# Altium schematic sheet P20_Mini PCIe 4G_5G.SchDoc
size 420 x 297 mm
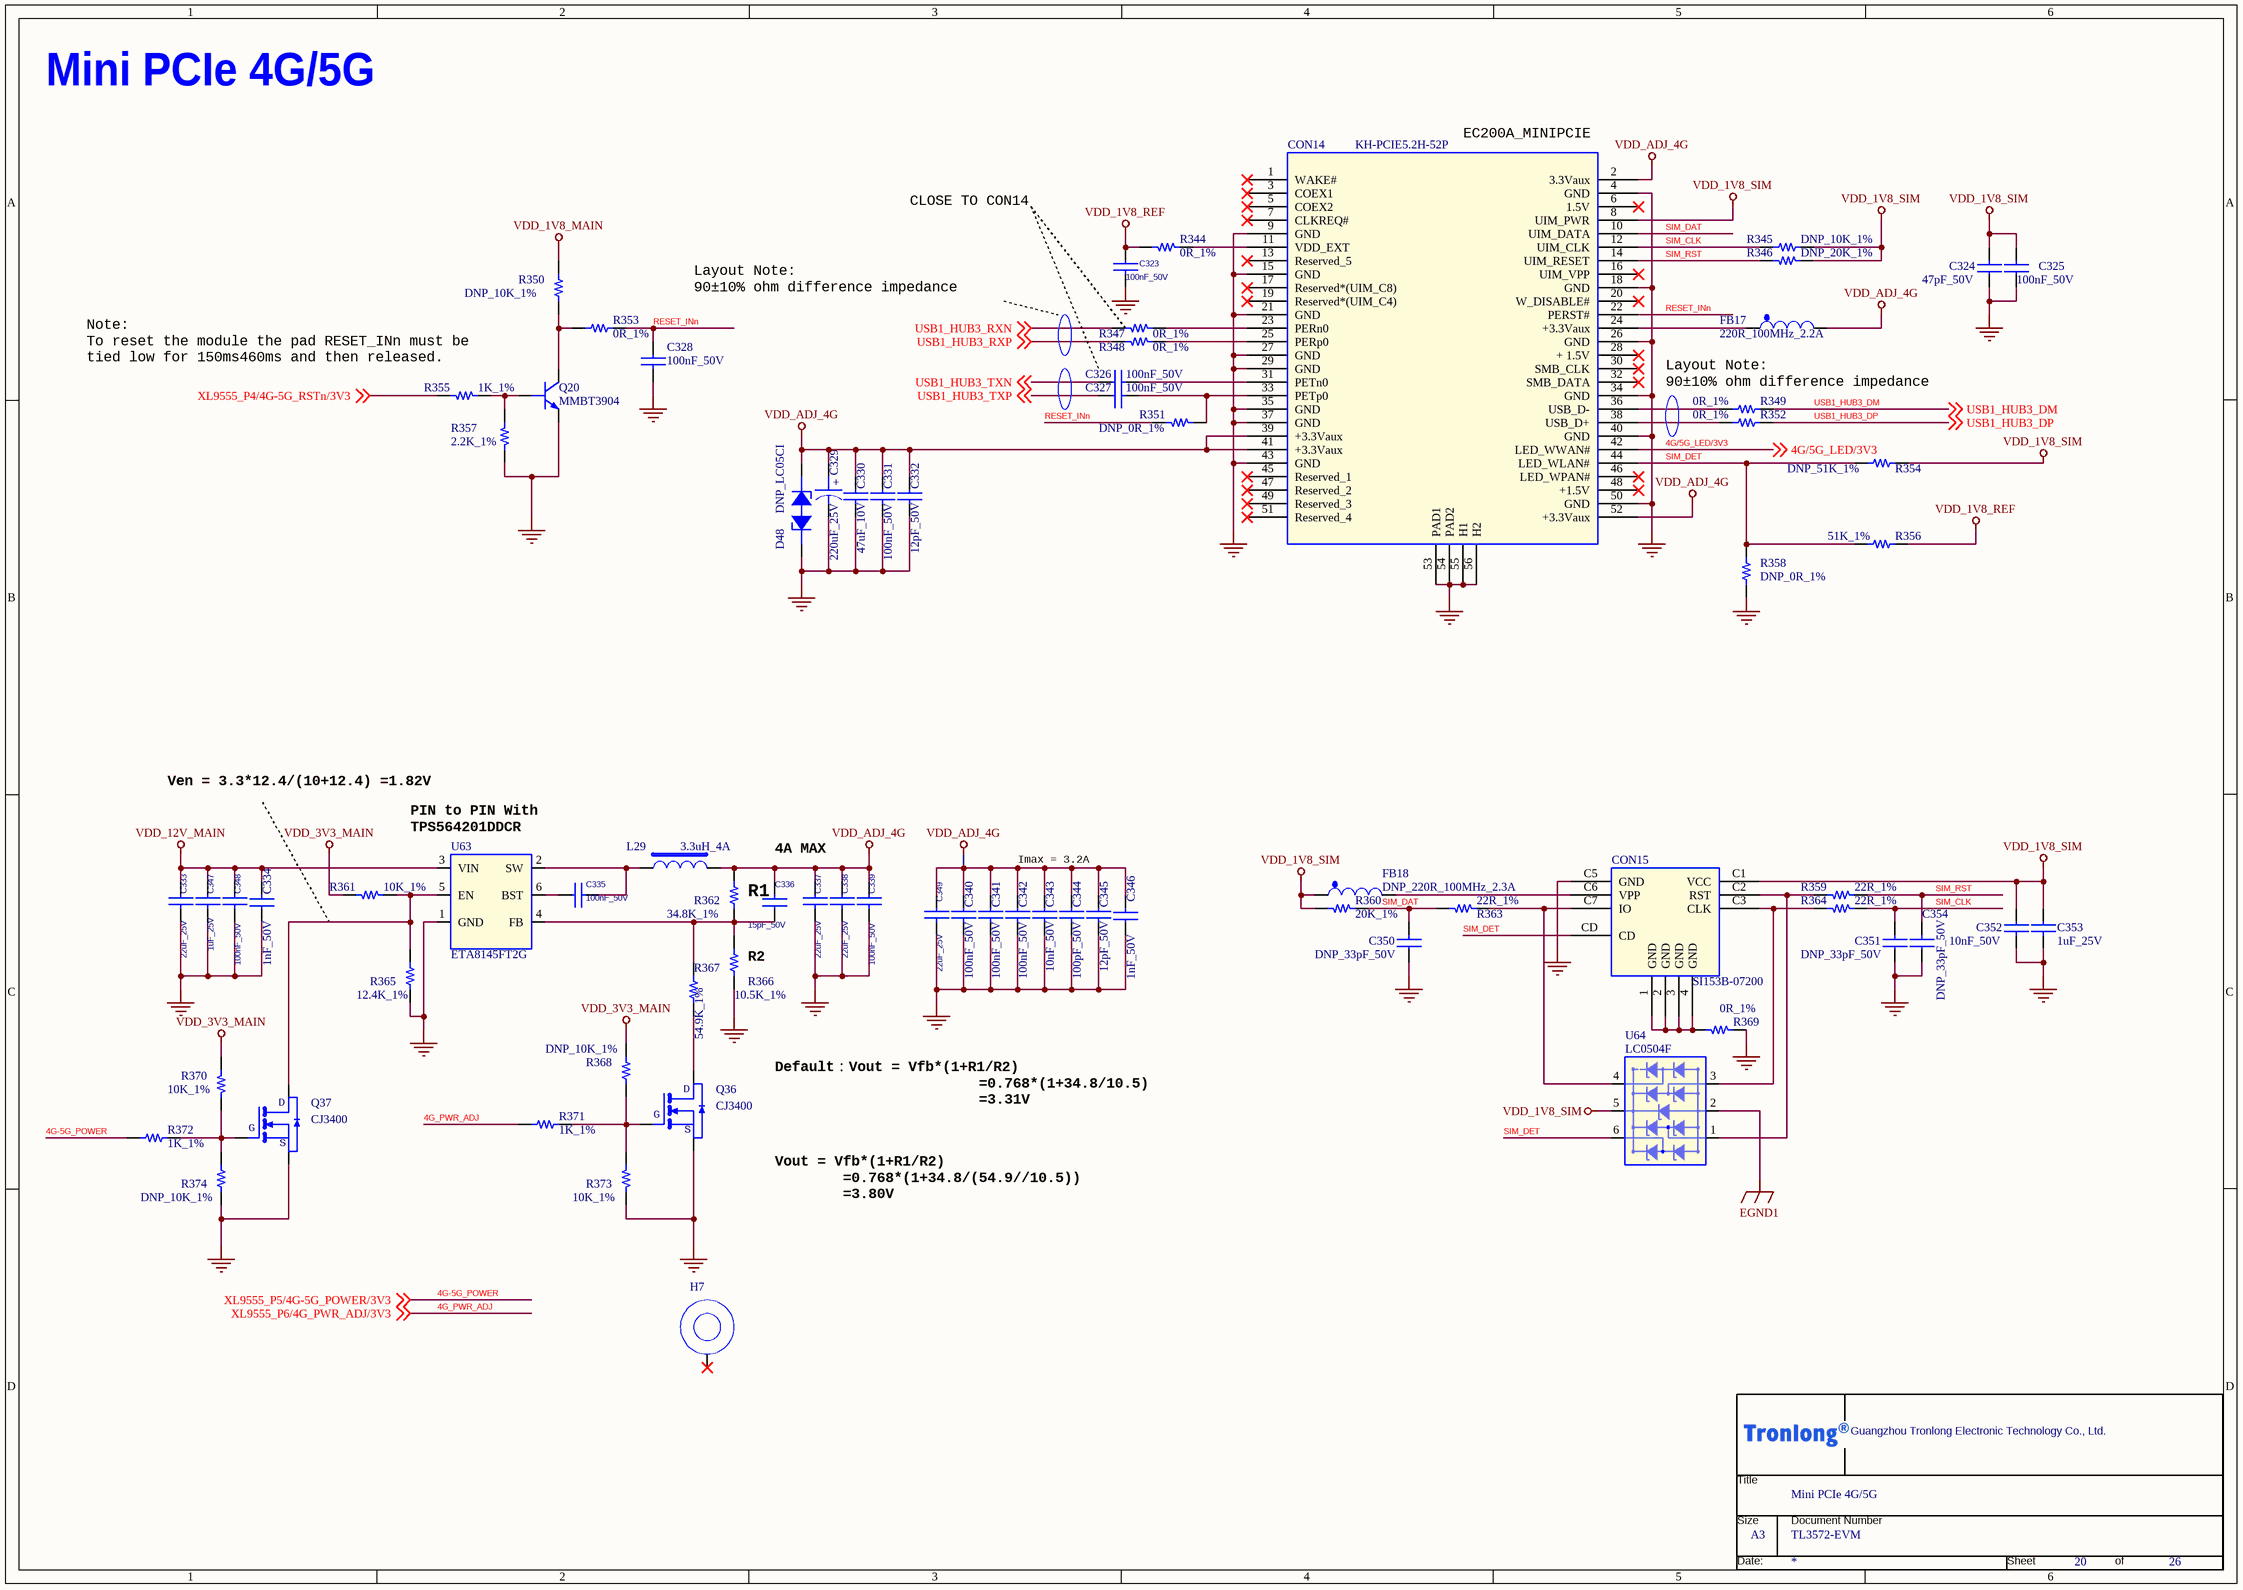
[diagram p0: P20_Mini PCIe 4G_5G.SchDoc]

## Parts
*  Doc: TL3572-EVM  Title: Mini PCIe 4G/5G  OrgName: Guangzhou Tronlong Electronic Technology Co., Ltd.  Page Size: A3  Page Number: 20  Page Count: 26  (hidden comment: Tronlong_TITTLE_20211115)  (graphical)
C323  100nF_50V  [C0402]
C324  47pF_50V  [C0402]
C325  100nF_50V  [C0402]
C326  100nF_50V  [C0402]
C327  100nF_50V  [C0402]
C328  100nF_50V  [C0402]
C329  220uF_25V  [SMD-ALU-L66H66]
C330  47uF_10V  [C0805]
C331  100nF_50V  [C0402]
C332  12pF_50V  [C0402]
C333  22uF_25V  [C0805]
C334  1nF_50V  [C0402]
C335  100nF_50V  [C0402]
C336  15pF_50V  [C0603]
C337  22uF_25V  [C0805]
C338  22uF_25V  [C0805]
C339  100nF_50V  [C0402]
C340  100nF_50V  [C0402]
C341  100nF_50V  [C0402]
C342  100nF_50V  [C0402]
C343  10nF_50V  [C0402]
C344  100pF_50V  [C0402]
C345  12pF_50V  [C0402]
C346  1nF_50V  [C0402]
C347  1uF_25V  [C0402]
C348  100nF_50V  [C0402]
C349  22uF_25V  [C0805]
C350  DNP_33pF_50V  [C0402]
C351  DNP_33pF_50V  [C0402]
C352  10nF_50V  [C0402]
C353  1uF_25V  [C0402]
C354  DNP_33pF_50V  [C0402]
CON14  KH-PCIE5.2H-52P  [aaa-pci-047-k01]
CON15  SI153B-07200  [SIM_SI124C-01200]
D48  DNP_LC05CI  [SOD323_BI]
FB17  220R_100MHz_2.2A  [L0603]
FB18  DNP_220R_100MHz_2.3A  [L0603]
H7  HOLE  [NHOLE_C5_BT]  (value not drawn)
L29  3.3uH_4A  [SMD-L5452M-2P]
Q20  MMBT3904  [SOT23-3_DBZ3]
Q36  CJ3400  [SOT23-3]
Q37  CJ3400  [SOT23-3]
R344  0R_1%  [R0402]
R345  DNP_10K_1%  [R0402]
R346  DNP_20K_1%  [R0402]
R347  0R_1%  [R0402]
R348  0R_1%  [R0402]
R349  0R_1%  [R0402]
R350  DNP_10K_1%  [R0402]
R351  DNP_0R_1%  [R0402]
R352  0R_1%  [R0402]
R353  0R_1%  [R0402]
R354  DNP_51K_1%  [R0402]
R355  1K_1%  [R0402]
R356  51K_1%  [R0402]
R357  2.2K_1%  [R0402]
R358  DNP_0R_1%  [R0402]
R359  22R_1%  [R0402]
R360  20K_1%  [R0603]
R361  10K_1%  [R0402]
R362  34.8K_1%  [R0402]
R363  22R_1%  [R0402]
R364  22R_1%  [R0402]
R365  12.4K_1%  [R0402]
R366  10.5K_1%  [R0402]
R367  54.9K_1%  [R0402]
R368  DNP_10K_1%  [R0402]
R369  0R_1%  [R0402]
R370  10K_1%  [R0402]
R371  1K_1%  [R0402]
R372  1K_1%  [R0402]
R373  10K_1%  [R0402]
R374  DNP_10K_1%  [R0402]
U63  ETA8145FT2G  [SOT-23-6L]
U64  LC0504F  [SOT363]

## Nets
EGND1: U64.2
GND: C323.2 C324.1 C325.1 C328.2 C329.2 C330.2 C331.2 C332.2 C333.2 C334.1 C337.2 C338.2 C339.2 C340.2 C341.2 C342.2 C343.2 C344.2 C345.2 C346.1 C347.2 C348.2 C349.2 C350.1 C351.1 C352.2 C353.2 C354.1 CON14.4(GND) CON14.9(GND) CON14.15(GND) CON14.18(GND) CON14.21(GND) CON14.26(GND) CON14.27(GND) CON14.29(GND) CON14.34(GND) CON14.35(GND) CON14.37(GND) CON14.40(GND) CON14.43(GND) CON14.50(GND) CON14.53(PAD1) CON14.54(PAD2) CON14.55(H1) CON14.56(H2) CON15.C5(GND) D48.2(CATHODE2) Q20.2(E) Q36.2(E) Q37.2(E) R357.2 R358.2 R365.1 R366.1 R369.1 R373.2 R374.2 U63.1(GND)
VDD_1V8_MAIN: R350.2
VDD_1V8_REF: C323.1 R344.1 R356.1
VDD_1V8_SIM: C324.2 C325.2 C352.1 C353.1 CON14.8(UIM_PWR) CON15.C1(VCC) FB18.1 R345.2 R346.2 R354.1 R360.1 U64.5
VDD_3V3_MAIN: R361.1 R368.1 R370.2
VDD_12V_MAIN: C333.1 C334.2 C347.1 C348.1 U63.3(VIN)
VDD_ADJ_4G: C329.1 C330.1 C331.1 C332.1 C336.2 C337.1 C338.1 C339.1 C340.1 C341.1 C342.1 C343.1 C344.1 C345.1 C346.2 C349.1 CON14.2(3.3Vaux) CON14.39(+3.3Vaux) CON14.41(+3.3Vaux) CON14.52(+3.3Vaux) D48.1(ANODE1) FB17.2 L29.2 R362.2
4G-5G_POWER: R372.1 ; off-sheet XL9555_P5/4G-5G_POWER/3V3  [also labelled XL9555_P5/4G-5G_POWER/3V3]
4G/5G_LED/3V3: CON14.42(LED_WWAN#) ; off-sheet 4G/5G_LED/3V3
4G_PWR_ADJ: R371.1 ; off-sheet XL9555_P6/4G_PWR_ADJ/3V3  [also labelled XL9555_P6/4G_PWR_ADJ/3V3]
RESET_INn: C328.1 CON14.22(PERST#) R351.1 R353.2
SIM_CLK: C351.2 CON14.12(UIM_CLK) R345.1 R364.2
SIM_DAT: C350.2 CON14.10(UIM_DATA) R360.2 R363.1
SIM_DET: CON14.44(LED_WLAN#) CON15.CD R354.2 R356.2 R358.1 U64.6
SIM_RST: C354.2 CON14.14(UIM_RESET) R346.1 R359.2
USB1_HUB3_DM: R349.2 ; off-sheet USB1_HUB3_DM
USB1_HUB3_DP: R352.2 ; off-sheet USB1_HUB3_DP
USB1_HUB3_RXN: R347.1 ; off-sheet USB1_HUB3_RXN
USB1_HUB3_RXP: R348.1 ; off-sheet USB1_HUB3_RXP
USB1_HUB3_TXN: C326.1 ; off-sheet USB1_HUB3_TXN
USB1_HUB3_TXP: C327.1 ; off-sheet USB1_HUB3_TXP
XL9555_P4/4G-5G_RSTn/3V3: R355.1 ; off-sheet XL9555_P4/4G-5G_RSTn/3V3
NetC326_2: C326.2 CON14.31(PETn0)
NetC327_2: C327.2 CON14.33(PETp0) R351.2
NetC335_1: C335.1 U63.6(BST)
NetC335_2: C335.2 L29.1 U63.2(SW)
NetC336_1: C336.1 R362.1 R366.2 R367.2 U63.4(FB)
NetCON14_11: CON14.11(VDD_EXT) R344.2
NetCON14_23: CON14.23(PERn0) R347.2
NetCON14_24: CON14.24(+3.3Vaux) FB17.1
NetCON14_25: CON14.25(PERp0) R348.2
NetCON14_36: CON14.36(USB_D-) R349.1
NetCON14_38: CON14.38(USB_D+) R352.1
NetCON15_1: CON15.1(GND) CON15.2(GND) CON15.3(GND) CON15.4(GND) R369.2
NetCON15_C2: CON15.C2(RST) R359.1 U64.1
NetCON15_C3: CON15.C3(CLK) R364.1 U64.3
NetCON15_C6: CON15.C6(VPP) FB18.2
NetCON15_C7: CON15.C7(IO) R363.2 U64.4
NetQ20_1: Q20.1(B) R355.2 R357.1
NetQ20_3: Q20.3(C) R350.1 R353.1
NetQ36_1: Q36.1(B) R368.2 R371.2 R373.1
NetQ36_3: Q36.3(C) R367.1
NetQ37_1: Q37.1(B) R370.1 R372.2 R374.1
NetQ37_3: Q37.3(C) R361.2 R365.2 U63.5(EN)

Not connected (* = marked no-connect by the designer): CON14 1(WAKE#)* 3(COEX1)* 5(COEX2)* 6(1.5V)* 7(CLKREQ#)* 13(Reserved_5)* 16(UIM_VPP)* 17(Reserved*(UIM_C8))* 19(Reserved*(UIM_C4))* 20(W_DISABLE#)* 28(+_1.5V)* 30(SMB_CLK)* 32(SMB_DATA)* 45(Reserved_1)* 46(LED_WPAN#)* 47(Reserved_2)* 48(+1.5V)* 49(Reserved_3)* 51(Reserved_4)*; H7 1*

## Notes on the sheet
- Mini PCIe 4G/5G
- (near CON14) EC200A_MINIPCIE
- CLOSE TO CON14
- Layout Note:
  90±10% ohm difference impedance
- Note:
  To reset the module the pad RESET_INn must be
  tied low for 150ms460ms and then released.
- Ven = 3.3*12.4/(10+12.4) =1.82V
- (near U63) PIN to PIN With
  TPS564201DDCR
- 4A MAX
- Imax = 3.2A
- R1
- (near R366) R2
- Default：Vout = Vfb*(1+R1/R2)
  =0.768*(1+34.8/10.5)
  =3.31V
- Vout = Vfb*(1+R1/R2)
  =0.768*(1+34.8/(54.9//10.5))
  =3.80V
- (in symbol CAP POL) +
- (in symbol MOSFET N SOT) D; G; S
- (in symbol Tronlong_TITTLE_20211115) Title; Size; Document Number; Date:; Sheet; of

## Library data of the parts
* = Tronlong_TITTLE_20211115: RevCode: A?; Page Create Date: March  8, 1995; Page Modify Date: *
C323 = CAP NP_Dup2: 贴片陶瓷电容,100nF,10%,50V,X7R; Manufacturer Character: 中国大陆; Manufacturer: 广东风华高新科技股份有限公司（FH）; Manufacturer PartNumber: 0402B104K500NT; Eco-Label: ROHS; ERP Number: 005.0001.0001.00681; Operation Temperature（℃）: -55~+125(Ta); As-Welded: /; PCB Footprint: C0402; Part Status: 试用; ERP PCB Footprint: C0402; Temperature: -55~125℃
C324 = CAP NP: CC0402JRNPO9BN470; Manufacturer: 广州创龙; Manufacturer PartNumber: 47pF,5%,C0402,50V,（X7R,X5R,COG,NPO或X7S）; Eco-Label: ROHS; ERP PCB Footprint: C0603; ERP Number: 005.0001.0022.00100; As-Welded: /; Operation Temperature（℃）: -40~+85(Ta); PCB Footprint: C0402; Temperature: -55~125℃; Manufacturer Character: -; Part Status: -
C325 = CAP NP: 贴片陶瓷电容,100nF,10%,50V,X7R; Manufacturer: 广东风华高新科技股份有限公司（FH）; Manufacturer PartNumber: 0402B104K500NT; Manufacturer Character: 中国大陆; Eco-Label: ROHS; ERP Number: 005.0001.0001.00681; Operation Temperature（℃）: -55~+125(Ta); As-Welded: /; PCB Footprint: C0402; Part Status: 试用; ERP PCB Footprint: C0402; Temperature: -55~125℃
C326 C327 = CAP NP_Dup2: 贴片陶瓷电容,100nF,10%,50V,X7R; Manufacturer: 广东风华高新科技股份有限公司（FH）; Manufacturer PartNumber: 0402B104K500NT; Manufacturer Character: 中国大陆; Eco-Label: ROHS; ERP Number: 005.0001.0001.00681; Operation Temperature（℃）: -55~+125(Ta); As-Welded: /; PCB Footprint: C0402; ERP PCB Footprint: C0402; Part Status: 试用
C328 = CAP NP: 贴片陶瓷电容,100nF,10%,50V,X7R; Manufacturer PartNumber: 0402B104K500NT; Manufacturer: 广东风华高新科技股份有限公司（FH）; Manufacturer Character: 中国大陆; ERP Number: 005.0001.0001.00681; Operation Temperature（℃）: -55~+125(Ta); As-Welded: /; Eco-Label: ROHS; PCB Footprint: C0402; Temperature: -55~125℃; ERP PCB Footprint: C0402; Part Status: 试用
C329 = CAP POL: 贴片式铝电解电容,220uF,20%,25V; Manufacturer PartNumber: HDS1E221M0607VG; Manufacturer: 东莞市合粤电子有限公司（Heyue）; Manufacturer Character: 中国大陆; Eco-Label: ROHS; ERP PCB Footprint: SMD-ALU-L90H83; ERP Number: 005.0001.0001.00688; room: DCIN; Operation Temperature（℃）: -55~+105(Ta); As-Welded: /; PCB Footprint: SMD-ALU-L66H66; Temperature: -55~125℃; Part Status: 测评
C330 = CAP NP: 贴片陶瓷电容,47uF,20%,10V,X5R; Manufacturer PartNumber: 0805X476M100NT; Manufacturer: 广东风华高新科技股份有限公司（FH）; Manufacturer Character: 中国大陆; Eco-Label: ROHS; ERP PCB Footprint: C1206; Operation Temperature（℃）: -55~+85(Ta); As-Welded: /; ERP Number: 005.0001.0001.00621; PCB Footprint: C0805; Temperature: -55~125℃; Part Status: 试用
C331 = CAP NP: 贴片陶瓷电容,100nF,10%,50V,X7R; Manufacturer PartNumber: 0402B104K500NT; Manufacturer: 广东风华高新科技股份有限公司（FH）; Manufacturer Character: 中国大陆; Eco-Label: ROHS; ERP Number: 005.0001.0001.00681; Operation Temperature（℃）: -55~+125(Ta); As-Welded: /; PCB Footprint: C0402; Part Status: 试用; ERP PCB Footprint: C0402; Temperature: -55~125℃
C332 = CAP NP: 贴片陶瓷电容,12pF,5%,50V,COG; Manufacturer PartNumber: 0402CG120J500NT; Manufacturer: 广东风华高新科技股份有限公司（FH）; Manufacturer Character: 中国大陆; Eco-Label: ROHS; Operation Temperature（℃）: -55~+125(Ta); As-Welded: /; ERP Number: 005.0001.0001.00612; PCB Footprint: C0402; Temperature: -55~125℃; ERP PCB Footprint: C0402; Part Status: 试用
C333 = CAP NP_Dup2: 贴片陶瓷电容,22uF,20%,25V,X5R; Manufacturer Character: 中国大陆; Manufacturer PartNumber: 0805X226M250NT; Manufacturer: 广东风华高新科技股份有限公司（FH）; Operation Temperature（℃）: -55~+85(Ta); As-Welded: /; ERP Number: 005.0001.0001.00524; Eco-Label: ROHS; PCB Footprint: C0805; Part Status: 优选; Temperature: -55~125℃; ERP PCB Footprint: C0805
C334 = CAP NP_1: 贴片陶瓷电容,1nF,10%,50V,X7R; Manufacturer: 广东风华高新科技股份有限公司（FH）; Manufacturer PN: GRM033R61E102KA01; Manufacturer Character: 中国大陆; Manufacturer PartNumber: 0402B102K500NT; ERP Number: 005.0001.0001.00523; RK PN: 902003109; Priority: A; Operation Temperature（℃）: -55~+125(Ta); As-Welded: /; Eco-Label: ROHS; Part Status: 优选; Part Type: 一般用片状陶瓷电容; Tolerance: ±10%; Created by: JJJ; ERP PCB Footprint: C0402
C335 = CAP NP_Dup2: 贴片陶瓷电容,100nF,10%,50V,X7R; Manufacturer: 广东风华高新科技股份有限公司（FH）; Manufacturer PartNumber: 0402B104K500NT; Manufacturer Character: 中国大陆; ERP Number: 005.0001.0001.00681; As-Welded: /; Operation Temperature（℃）: -55~+125(Ta); Eco-Label: ROHS; PCB Footprint: C0402; Temperature: -55~125℃; ERP PCB Footprint: C0402; Part Status: 试用
C336 = CAP NP_Dup2: CL10C150JB8NNNC,CC0603JRNPO9BN150; Manufacturer: 广州创龙; Manufacturer PartNumber: 15pF,5%,C0603,50V,（X7R,X5R,COG,NPO或X7S）; ERP PCB Footprint: C0402; Eco-Label: ROHS; As-Welded: /; Operation Temperature（℃）: -40~+85(Ta); ERP Number: 005.0001.0022.00126; PCB Footprint: C0603; Part Status: -; Manufacturer Character: -; Temperature: -55~125℃
C337 = CAP NP_Dup2: 贴片陶瓷电容,22uF,20%,25V,X5R; Manufacturer Character: 中国大陆; Manufacturer PartNumber: 0805X226M250NT; Manufacturer: 广东风华高新科技股份有限公司（FH）; Eco-Label: ROHS; ERP PCB Footprint: C0603; ERP Number: 005.0001.0001.00524; As-Welded: /; Operation Temperature（℃）: -55~+85(Ta); PCB Footprint: C0805; Part Status: 优选; Temperature: -55~125℃
C338 C349 = CAP NP_Dup2: 贴片陶瓷电容,22uF,20%,25V,X5R; Manufacturer: 广东风华高新科技股份有限公司（FH）; Manufacturer PartNumber: 0805X226M250NT; Manufacturer Character: 中国大陆; Eco-Label: ROHS; ERP PCB Footprint: C0603; Operation Temperature（℃）: -55~+85(Ta); As-Welded: /; ERP Number: 005.0001.0001.00524; PCB Footprint: C0805; Part Status: 优选; Temperature: -55~125℃
C339 = CAP NP_Dup2: 贴片陶瓷电容,100nF,10%,50V,X7R; Manufacturer PartNumber: 0402B104K500NT; Manufacturer: 广东风华高新科技股份有限公司（FH）; Manufacturer Character: 中国大陆; Eco-Label: ROHS; Operation Temperature（℃）: -55~+125(Ta); As-Welded: /; ERP Number: 005.0001.0001.00681; PCB Footprint: C0402; Part Status: 试用; ERP PCB Footprint: C0402; Temperature: -55~125℃
C340 C341 = CAP NP: 贴片陶瓷电容,100nF,10%,50V,X7R; Manufacturer Character: 中国大陆; Manufacturer: 广东风华高新科技股份有限公司（FH）; Manufacturer PartNumber: 0402B104K500NT; ERP Number: 005.0001.0001.00681; As-Welded: /; Operation Temperature（℃）: -55~+125(Ta); Eco-Label: ROHS; PCB Footprint: C0402; Temperature: -55~125℃; ERP PCB Footprint: C0402; Part Status: 试用
C342 = CAP NP: 贴片陶瓷电容,100nF,10%,50V,X7R; Manufacturer PartNumber: 0402B104K500NT; Manufacturer: 广东风华高新科技股份有限公司（FH）; Manufacturer Character: 中国大陆; Eco-Label: ROHS; Operation Temperature（℃）: -55~+125(Ta); As-Welded: /; ERP Number: 005.0001.0001.00681; PCB Footprint: C0402; Part Status: 试用; ERP PCB Footprint: C0402; Temperature: -55~125℃
C343 = CAP NP: 贴片陶瓷电容,10nF,10%,50V,X7R; Manufacturer PartNumber: 0402B103K500NT; Manufacturer: 广东风华高新科技股份有限公司（FH）; Manufacturer Character: 中国大陆; Eco-Label: ROHS; As-Welded: /; Operation Temperature（℃）: -55~+125(Ta); ERP Number: 005.0001.0001.00522; PCB Footprint: C0402; Part Status: 优选; ERP PCB Footprint: C0402; Temperature: –55~125℃
C344 = CAP NP: 贴片陶瓷电容,100pF,5%,50V,COG; Manufacturer Character: 中国大陆; Manufacturer: 广东风华高新科技股份有限公司（FH）; Manufacturer PartNumber: 0402CG101J500NT; ERP Number: 005.0001.0001.00580; As-Welded: /; Operation Temperature（℃）: -55~+125(Ta); Eco-Label: EXEMPTION; PCB Footprint: C0402; Part Status: 优选; Temperature: -55~125℃; ERP PCB Footprint: C0402
C345 = CAP NP: 贴片陶瓷电容,12pF,5%,50V,COG; Manufacturer: 广东风华高新科技股份有限公司（FH）; Manufacturer PartNumber: 0402CG120J500NT; Manufacturer Character: 中国大陆; ERP Number: 005.0001.0001.00612; As-Welded: /; Operation Temperature（℃）: -55~+125(Ta); Eco-Label: ROHS; PCB Footprint: C0402; Part Status: 试用; ERP PCB Footprint: C0402; Temperature: -55~125℃
C346 = CAP NP_1: 贴片陶瓷电容,1nF,10%,50V,X7R; Manufacturer PartNumber: 0402B102K500NT; Manufacturer Character: 中国大陆; Manufacturer PN: GRM033R61E102KA01; Manufacturer: 广东风华高新科技股份有限公司（FH）; As-Welded: /; Operation Temperature（℃）: -55~+125(Ta); Priority: A; RK PN: 902003109; ERP Number: 005.0001.0001.00523; Eco-Label: ROHS; Part Status: 优选; Created by: JJJ; Tolerance: ±10%; Part Type: 一般用片状陶瓷电容; ERP PCB Footprint: C0402
C347 C353 = CAP NP_Dup2: 贴片陶瓷电容,1uF,10%,25V,X5R; Manufacturer PartNumber: 0402X105K250NT; Manufacturer: 广东风华高新科技股份有限公司（FH）; Manufacturer Character: 中国大陆; Eco-Label: ROHS; ERP Number: 005.0001.0001.00640; As-Welded: /; Operation Temperature（℃）: -55~+85(Ta); PCB Footprint: C0402; ERP PCB Footprint: C0402; Part Status: 试用
C348 = CAP NP_Dup2: 贴片陶瓷电容,100nF,10%,50V,X7R; Manufacturer Character: 中国大陆; Manufacturer: 广东风华高新科技股份有限公司（FH）; Manufacturer PartNumber: 0402B104K500NT; Eco-Label: ROHS; Operation Temperature（℃）: -55~+125(Ta); As-Welded: /; ERP Number: 005.0001.0001.00681; PCB Footprint: C0402; Part Status: 试用; ERP PCB Footprint: C0402; Temperature: -55~125℃
C350 C354 = CAP NP_Dup2: 贴片陶瓷电容,33pF,5%,50V,COG; Manufacturer Character: 中国大陆; Manufacturer PartNumber: 0402CG330J500NT; Manufacturer: 广东风华高新科技股份有限公司（FH）; ERP Number: 005.0001.0001.00658; Operation Temperature（℃）: -55~+125(Ta); As-Welded: DNP; Eco-Label: ROHS; PCB Footprint: C0402; Temperature: -55~155℃; ERP PCB Footprint: C0402; Part Status: 试用
C351 = CAP NP_Dup2: 贴片陶瓷电容,33pF,5%,50V,COG; Manufacturer Character: 中国大陆; Manufacturer: 广东风华高新科技股份有限公司（FH）; Manufacturer PartNumber: 0402CG330J500NT; ERP Number: 005.0001.0001.00658; Operation Temperature（℃）: -55~+125(Ta); As-Welded: DNP; Eco-Label: ROHS; PCB Footprint: C0402; Temperature: -55~155℃; ERP PCB Footprint: C0402; Part Status: 试用
C352 = CAP NP_Dup2: 贴片陶瓷电容,10nF,10%,50V,X7R; Manufacturer Character: 中国大陆; Manufacturer PartNumber: 0402B103K500NT; Manufacturer: 广东风华高新科技股份有限公司（FH）; Operation Temperature（℃）: -55~+125(Ta); As-Welded: /; ERP Number: 005.0001.0001.00522; Eco-Label: ROHS; PCB Footprint: C0402; Part Status: 优选; Temperature: –55~125℃; ERP PCB Footprint: C0402
CON14 = CON_mSATA_2: 贴片mini PCIE插槽,52P,0.8mm间距,母座,H=5.2mm; Manufacturer: 深圳市金航标电子有限公司(kinghelm); Manufacturer Character: 中国大陆; ERP Number: 005.0001.0003.00514; Operation Temperature（℃）: /; ERP PCB Footprint: CON_MNPCIE_52P_0D8_SMD; Eco-Label: ROHS; PCB Footprint: aaa-pci-047-k01; Part Status: 优选; As-Welded: /; Manufacturer PartNumber: KH-PCIE5.2H-52P; Temperature: -25~80℃
CON15 = SI124C-01200_3: Nano SIM卡座,7P,1.27mm间距,自弹,带检测脚; Manufacturer: 深圳市爱特姆科技有限公司（ATOM）; Manufacturer Character: 中国大陆; As-Welded: /; Operation Temperature（℃）: -40~+85(Ta); ERP Number: 005.0001.0003.00758; ERP PCB Footprint: CON_nano SIM_7P_1D27_SMD; Eco-Label: ROHS; PCB Footprint: SIM_SI124C-01200; Part Status: 测评; Manufacturer PartNumber: SI153B-07200
D48 = DIODE BREAKDOWN_2: TVS二极管,VRWM=5V,VBR=6V,一组,双向,30KV,30KV; Manufacturer Part Number: PESD3V3L1BA; Manufacturer PartNumber: LC05CI; Manufacturer: 上海雷卯电子科技有限公司（Leiditech）; Manufacturer Character: 中国大陆; Eco-Label: ROHS; ERP PCB Footprint: SOD323; As-Welded: DNP; Operation Temperature（℃）: -55~+125(Tj); room: KEY; ERP Number: 005.0001.0017.00060; PCB Footprint: SOD323_BI; Temperature: -55~155℃; Part Status: 优选
FB17 = FERRITE BEAD_Dup1: 磁珠,50mΩ,2.2A,220R@100MHz; Manufacturer Character: 中国大陆; Manufacturer: 深圳顺络电子股份有限公司（Sunlord）; Manufacturer PartNumber: UPZ1608U221-2R2TF; Eco-Label: ROHS; ERP PCB Footprint: L0603I; ERP Number: 005.0001.0007.00015; As-Welded: /; Operation Temperature（℃）: -55~+125(Ta); PCB Footprint: L0603; Temperature: -55~125; Part Status: 限选
FB18 = FB_0: 磁珠,50mΩ,2.3A,220R@100MHz; Manufacturer PartNumber: UPZ1608U221-2R3TF; Manufacturer: 深圳顺络电子股份有限公司（Sunlord）; Manufacturer Character: 中国大陆; Eco-Label: ROHS; ERP PCB Footprint: L0603I; Operation Temperature（℃）: -55~+125(Ta); As-Welded: DNP; room: 6; ERP Number: 005.0001.0007.00023; PCB Footprint: L0603; Temperature: -55~125℃; Part Status: 测评
H7 = HOLE: Manufacturer Character: 中国大陆; Operation Temperature（℃）: /; As-Welded: DNP; PCB Footprint: NHOLE_C5_BT
L29 = INDUCTOR: 贴片功率电感,3.3uH,0.058Ω,Isat=5A,Irms=4A; Manufacturer Character: 中国大陆; Manufacturer PartNumber: CSAB0518-3R3M; Manufacturer: 深圳市科达嘉电子有限公司（CODACA）; Parameter: L2520，奇力新一体成型电感，最大额定电流3A，内阻65毫欧，20%; Eco-Label: ROHS; ERP Number: 005.0001.0006.00124; Operation Temperature（℃）: -40~+125(Ta); As-Welded: /; PCB Footprint: SMD-L5452M-2P; ERP PCB Footprint: SMD-L5452M-2P; Temperature: -40~125℃; Part Status: 试用
Q20 = MMBT3904/SOT: BJT,NPN,Vceo=40V,Ic=200mA,fT=300MHz,PD=200mW; Manufacturer: 江苏长晶科技股份有限公司（JSCJ）; Manufacturer Character: 中国大陆; ERP Number: 005.0001.0008.00002; Operation Temperature（℃）: -55~+150(Tj); As-Welded: /; ERP PCB Footprint: SOT-23; Eco-Label: ROHS; PCB Footprint: SOT23-3_DBZ3; Part Status: 优选; Manufacturer PartNumber: MMBT3904; Temperature: -55~150℃
Q36 = MOSFET N SOT: MOSFET,N沟道,VDSS=30V,VGSS=±12V,ID=5.8A,PD=0.35W,VGS(th)=1.4V; Manufacturer: 江苏长晶科技股份有限公司（JSCJ）; Manufacturer Character: 中国大陆; Eco-Label: ROHS; ERP Number: 005.0001.0009.00027; Operation Temperature（℃）: -55~+150(Tj); ROOM: DSP_LED; As-Welded: /; PCB Footprint: SOT23-3; Manufacturer PartNumber: CJ3400; Temperature: -55~150℃; Part Status: 优选
Q37 = MOSFET N SOT: MOSFET,N沟道,VDSS=30V,VGSS=±12V,ID=5.8A,PD=0.35W,VGS(th)=1.4V; Manufacturer Character: 中国大陆; Manufacturer: 江苏长晶科技股份有限公司（JSCJ）; As-Welded: /; ROOM: DSP_LED; Operation Temperature（℃）: -55~+150(Tj); ERP Number: 005.0001.0009.00027; Eco-Label: ROHS; PCB Footprint: SOT23-3; Part Status: 优选; Temperature: -55~150℃; Manufacturer PartNumber: CJ3400
R344 = Resistor_Dup3: 贴片电阻,0R,±1%,1/16W; Manufacturer: 广东风华高新科技股份有限公司（FH）; Manufacturer PartNumber: RC-02000FT; Manufacturer Character: 中国大陆; CLASS: DISCRETE; ERP Number: 005.0001.0002.00938; Operation Temperature（℃）: -55~+155(Ta); As-Welded: /; Eco-Label: ROHS; PCB Footprint: R0402; Part Status: 优选; Temperature: –55~155℃; ERP PCB Footprint: R0402
R345 = Resistor_Dup3: 贴片电阻,10K,±1%,1/16W; Manufacturer: 广东风华高新科技股份有限公司（FH）; Manufacturer Character: 中国大陆; Manufacturer PartNumber: RC-02K1002FT; CLASS: DISCRETE; ERP Number: 005.0001.0002.01326; room: USB HUB; Operation Temperature（℃）: -55~+125(Ta); As-Welded: DNP; Eco-Label: ROHS; PCB Footprint: R0402; Part Status: 优选; ERP PCB Footprint: R0402
R346 = R 1%: 贴片电阻,20K,±1%,1/16W; Manufacturer Character: 中国大陆; Manufacturer PartNumber: RC-02K2002FT; Manufacturer: 广东风华高新科技股份有限公司（FH）; CLASS: DISCRETE; Characteristic: 0402 1/16W +/-1%; Eco-Label: ROHS; As-Welded: DNP; Operation Temperature（℃）: -55~+125(Ta); ERP Number: 005.0001.0002.01357; PCB Footprint: R0402; Part Status: 试用; ERP PCB Footprint: R0402; Temperature: -55~155℃
R347 R369 = Resistor_Dup3: 贴片电阻,0R,±1%,1/16W; Manufacturer Character: 中国大陆; Manufacturer PartNumber: RC-02000FT; Manufacturer: 广东风华高新科技股份有限公司（FH）; CLASS: DISCRETE; Eco-Label: ROHS; ERP Number: 005.0001.0002.00938; As-Welded: /; Operation Temperature（℃）: -55~+155(Ta); PCB Footprint: R0402; Part Status: 优选; ERP PCB Footprint: R0402; Temperature: –55~155℃
R348 = Resistor_Dup3: 贴片电阻,0R,±1%,1/16W; Manufacturer: 广东风华高新科技股份有限公司（FH）; Manufacturer PartNumber: RC-02000FT; Manufacturer Character: 中国大陆; CLASS: DISCRETE; Operation Temperature（℃）: -55~+155(Ta); As-Welded: /; ERP Number: 005.0001.0002.00938; Eco-Label: ROHS; PCB Footprint: R0402; Temperature: –55~155℃; ERP PCB Footprint: R0402; Part Status: 优选
R349 R353 = R 1%: 贴片电阻,0R,±1%,1/16W; Manufacturer PartNumber: RC-02000FT; Manufacturer: 广东风华高新科技股份有限公司（FH）; Manufacturer Character: 中国大陆; CLASS: DISCRETE; Characteristic: 0402 1/16W +/-1%; Eco-Label: ROHS; ERP Number: 005.0001.0002.00938; As-Welded: /; Operation Temperature（℃）: -55~+155(Ta); PCB Footprint: R0402; ERP PCB Footprint: R0402; Temperature: –55~155℃; Part Status: 优选
R350 = Resistor_Dup1: 贴片电阻,10K,±1%,1/16W; Manufacturer: 广东风华高新科技股份有限公司（FH）; Manufacturer PartNumber: RC-02K1002FT; Manufacturer Character: 中国大陆; CLASS: DISCRETE; ERP Number: 005.0001.0002.01326; Operation Temperature（℃）: -55~+125(Ta); AGILE_PN: 470-79719; Tolerance: 5%; MFG_NAME01: RALEC ELECTRONIC CORP; MFG_PN01: RTT01103JTH; CAD_APPROVED: Yes; FPLIST: RC0201,C0201; As-Welded: DNP; Eco-Label: ROHS; PCB Footprint: R0402; Part Status: 优选; ERP PCB Footprint: R0402; ROHS: Yes; HEIGHT: 0.26 MM
R351 = Resistor_Dup3: 贴片电阻,0R,±1%,1/16W; Manufacturer: 广东风华高新科技股份有限公司（FH）; Manufacturer PartNumber: RC-02000FT; Manufacturer Character: 中国大陆; CLASS: DISCRETE; Eco-Label: ROHS; ERP Number: 005.0001.0002.00938; Operation Temperature（℃）: -55~+155(Ta); As-Welded: DNP; PCB Footprint: R0402; Part Status: 优选; ERP PCB Footprint: R0402; Temperature: –55~155℃
R352 = R 1%: 贴片电阻,0R,±1%,1/16W; Manufacturer Character: 中国大陆; Manufacturer: 广东风华高新科技股份有限公司（FH）; Manufacturer PartNumber: RC-02000FT; CLASS: DISCRETE; Characteristic: 0402 1/16W +/-1%; Operation Temperature（℃）: -55~+155(Ta); As-Welded: /; ERP Number: 005.0001.0002.00938; Eco-Label: ROHS; PCB Footprint: R0402; Part Status: 优选; Temperature: –55~155℃; ERP PCB Footprint: R0402
R354 = R 1%: RC0402FR-0751KL,0402WGF5102TCE; Manufacturer PartNumber: 51K,±1%,R0402,≥1/16W; Manufacturer: 广州创龙; CLASS: DISCRETE; Characteristic: 0402 1/16W +/-1%; Operation Temperature（℃）: -40~+85(Ta); As-Welded: DNP; ERP Number: 005.0001.0023.00198; Eco-Label: ROHS; PCB Footprint: R0402; Part Status: -; Temperature: -55~155℃; Manufacturer Character: -; ERP PCB Footprint: R0402
R355 = Resistor_Dup4: 贴片电阻,1K,±1%,1/16W; Manufacturer: 广东风华高新科技股份有限公司（FH）; Manufacturer PartNumber: RC-02K1001FT; Manufacturer Character: 中国大陆; CLASS: DISCRETE; Operation Temperature（℃）: -55~+125(Ta); As-Welded: /; ERP Number: 005.0001.0002.01327; Eco-Label: ROHS; PCB Footprint: R0402; Temperature: -55~155℃; ERP PCB Footprint: R0402; Part Status: 优选
R356 = R 1%: RC0402FR-0751KL,0402WGF5102TCE; Manufacturer PartNumber: 51K,±1%,R0402,≥1/16W; Manufacturer: 广州创龙; CLASS: DISCRETE; Characteristic: 0402 1/16W +/-1%; Operation Temperature（℃）: -40~+85(Ta); As-Welded: /; ERP Number: 005.0001.0023.00198; Eco-Label: ROHS; PCB Footprint: R0402; Part Status: -; Temperature: -55~155℃; Manufacturer Character: -; ERP PCB Footprint: R0402
R357 = Resistor_Dup4: 贴片电阻,2.2K,±1%,1/16W; Manufacturer: 广东风华高新科技股份有限公司（FH）; Manufacturer PartNumber: RC-02K2201FT; Manufacturer Character: 中国大陆; CLASS: DISCRETE; Operation Temperature（℃）: -55~+125(Ta); As-Welded: /; ERP Number: 005.0001.0002.01317; Eco-Label: ROHS; PCB Footprint: R0402; Part Status: 试用; Temperature: -55~155℃; ERP PCB Footprint: R0402
R358 = R 1%: 贴片电阻,0R,±1%,1/16W; Manufacturer PartNumber: RC-02000FT; Manufacturer: 广东风华高新科技股份有限公司（FH）; Manufacturer Character: 中国大陆; CLASS: DISCRETE; Characteristic: 0402 1/16W +/-1%; Operation Temperature（℃）: -55~+155(Ta); As-Welded: DNP; ERP Number: 005.0001.0002.00938; Eco-Label: ROHS; PCB Footprint: R0402; Temperature: -55~155℃; ERP PCB Footprint: R0402; Part Status: 优选
R359 = Resistor_Dup3: 贴片电阻,22R,±1%,1/16W; Manufacturer PartNumber: RC-02K22R0FT; Manufacturer: 广东风华高新科技股份有限公司（FH）; Manufacturer Character: 中国大陆; CLASS: DISCRETE; Eco-Label: ROHS; As-Welded: /; Operation Temperature（℃）: -55~+125(Ta); ERP Number: 005.0001.0002.01316; PCB Footprint: R0402; ERP PCB Footprint: R0402; Temperature: -55~155℃; Part Status: 试用
R360 = R 1%: 贴片电阻,20K,±1%,1/10W; Manufacturer Character: 中国大陆; Manufacturer PartNumber: RS-03K2002FT; Manufacturer: 广东风华高新科技股份有限公司（FH）; CLASS: DISCRETE; Characteristic: 0402 1/16W +/-1%; Eco-Label: ROHS; As-Welded: /; Operation Temperature（℃）: -55~+155(Ta); ERP Number: 005.0001.0002.01054; PCB Footprint: R0603; ERP PCB Footprint: R0603; Temperature: -55~155℃; Part Status: 优选
R361 = Resistor_Dup4: 贴片电阻,10K,±1%,1/16W; Manufacturer Character: 中国大陆; Manufacturer PartNumber: RC-02K1002FT; Manufacturer: 广东风华高新科技股份有限公司（FH）; CLASS: DISCRETE; Eco-Label: ROHS; As-Welded: /; Operation Temperature（℃）: -55~+125(Ta); ERP Number: 005.0001.0002.01326; PCB Footprint: R0402; Part Status: 优选; ERP PCB Footprint: R0402
R362 = Resistor_Dup3: 0402WGF3482TCE; Manufacturer: 广州创龙; Manufacturer PartNumber: 34.8K,±1%,R0402,≥1/16W; CLASS: DISCRETE; Operation Temperature（℃）: -40~+85(Ta); As-Welded: /; ERP Number: 005.0001.0023.00629; Eco-Label: ROHS; PCB Footprint: R0402; Part Status: 试用; Temperature: -55~155℃; Manufacturer Character: -; ERP PCB Footprint: R0402
R363 = Resistor_Dup3: 贴片电阻,22R,±1%,1/16W; Manufacturer: 广东风华高新科技股份有限公司（FH）; Manufacturer PartNumber: RC-02K22R0FT; Manufacturer Character: 中国大陆; CLASS: DISCRETE; As-Welded: /; Operation Temperature（℃）: -55~+125(Ta); ERP Number: 005.0001.0002.01316; Eco-Label: ROHS; PCB Footprint: R0402; Part Status: 试用; Temperature: -55~155℃; ERP PCB Footprint: R0402
R364 = Resistor_Dup3: 贴片电阻,22R,±1%,1/16W; Manufacturer Character: 中国大陆; Manufacturer PartNumber: RC-02K22R0FT; Manufacturer: 广东风华高新科技股份有限公司（FH）; CLASS: DISCRETE; ERP Number: 005.0001.0002.01316; Operation Temperature（℃）: -55~+125(Ta); As-Welded: /; Eco-Label: ROHS; PCB Footprint: R0402; Part Status: 试用; Temperature: -55~155℃; ERP PCB Footprint: R0402
R365 = Resistor_Dup3: 0402WGF1242TCE; Manufacturer PartNumber: 12.4K,±1%,R0402,≥1/16W; Manufacturer: 广州创龙; CLASS: DISCRETE; Eco-Label: ROHS; As-Welded: /; Operation Temperature（℃）: -40~+85(Ta); ERP Number: 005.0001.0023.00040; PCB Footprint: R0402; ERP PCB Footprint: R0402; Manufacturer Character: -; Temperature: -55~155℃; Part Status: -
R366 = Resistor_Dup3: RC0402FR-0710K5L,0402WGF1052TCE; Manufacturer: 广州创龙; Manufacturer PartNumber: 10.5K,±1%,R0402,≥1/16W; CLASS: DISCRETE; Eco-Label: ROHS; As-Welded: /; Operation Temperature（℃）: -40~+85(Ta); ERP Number: 005.0001.0023.00024; PCB Footprint: R0402; ERP PCB Footprint: R0402; Temperature: –55~155℃; Manufacturer Character: -; Part Status: -
R367 = Resistor_Dup3: RC0402FR-0754K9L,0402WGF5492TCE; Manufacturer: 广州创龙; Manufacturer PartNumber: 54.9K,±1%,R0402,≥1/16W; CLASS: DISCRETE; Eco-Label: ROHS; As-Welded: /; Operation Temperature（℃）: -40~+85(Ta); ERP Number: 005.0001.0023.00202; PCB Footprint: R0402; ERP PCB Footprint: R0402; Temperature: –55~155℃; Manufacturer Character: -; Part Status: -
R368 = Resistor_Dup3: 贴片电阻,10K,±1%,1/16W; Manufacturer: 广东风华高新科技股份有限公司（FH）; Manufacturer PartNumber: RC-02K1002FT; Manufacturer Character: 中国大陆; CLASS: DISCRETE; As-Welded: DNP; Operation Temperature（℃）: -55~+125(Ta); ERP Number: 005.0001.0002.01326; Eco-Label: ROHS; PCB Footprint: R0402; Part Status: 优选; ERP PCB Footprint: R0402; Temperature: –55~155℃
R370 R373 = Resistor_Dup4: 贴片电阻,10K,±1%,1/16W; Manufacturer: 广东风华高新科技股份有限公司（FH）; Manufacturer PartNumber: RC-02K1002FT; Manufacturer Character: 中国大陆; CLASS: DISCRETE; ERP Number: 005.0001.0002.01326; Operation Temperature（℃）: -55~+125(Ta); As-Welded: /; Eco-Label: ROHS; PCB Footprint: R0402; ERP PCB Footprint: R0402; Part Status: 优选
R371 = Resistor_Dup3: 贴片电阻,1K,±1%,1/16W; Manufacturer: 广东风华高新科技股份有限公司（FH）; Manufacturer Character: 中国大陆; Mistral Part No: 110009031036-R; Mfr_name: PANASONIC-ECG; Mfr_part_number: ERJ-2RNF6981V; Part_type: RESISTORS\FIXED; Manufacturer PartNumber: RC-02K1001FT; CLASS: DISCRETE; Eco-Label: ROHS; ERP Number: 005.0001.0002.01327; Operation Temperature（℃）: -55~+125(Ta); As-Welded: /; Project: TELEMETRY ENCODER; PCB Footprint: R0402; Package: 0402; Distributor_name: NA; Distributor_part_number: NA; Height: 0.40MM; ERP PCB Footprint: R0402; Part Status: 优选
R372 = Resistor_Dup3: 贴片电阻,1K,±1%,1/16W; Manufacturer PartNumber: RC-02K1001FT; Part_type: RESISTORS\FIXED; Mfr_part_number: ERJ-2RNF6981V; Mfr_name: PANASONIC-ECG; Mistral Part No: 110009031036-R; Manufacturer Character: 中国大陆; Manufacturer: 广东风华高新科技股份有限公司（FH）; CLASS: DISCRETE; Project: TELEMETRY ENCODER; As-Welded: /; Operation Temperature（℃）: -55~+125(Ta); ERP Number: 005.0001.0002.01327; Eco-Label: ROHS; PCB Footprint: R0402; Height: 0.40MM; Distributor_part_number: NA; Distributor_name: NA; Package: 0402; ERP PCB Footprint: R0402; Part Status: 优选
R374 = Resistor_Dup3: 贴片电阻,10K,±1%,1/16W; Manufacturer: 广东风华高新科技股份有限公司（FH）; Manufacturer PartNumber: RC-02K1002FT; Manufacturer Character: 中国大陆; CLASS: DISCRETE; Eco-Label: ROHS; As-Welded: DNP; Operation Temperature（℃）: -55~+125(Ta); ERP Number: 005.0001.0002.01326; PCB Footprint: R0402; Temperature: –55~155℃; ERP PCB Footprint: R0402; Part Status: 优选
U63 = WD1304E30_2: DC/DC,Buck,Vin:4.5V~17V,Vout:0.8-5.5V,4A,1路; Manufacturer: 钰泰半导体股份有限公司（ETA）; Manufacturer Character: 中国大陆; ERP Number: 005.0001.0019.00038; As-Welded: /; Operation Temperature（℃）: -40~+85(Ta); ERP PCB Footprint: FCTSOT23-6; Eco-Label: ROHS; PCB Footprint: SOT-23-6L; Part Status: 测评; Temperature: -40~85℃; Manufacturer PartNumber: ETA8145FT2G
U64 = PRTR5V0U4Y_0: ESD二极管,VRWM=5V,VBR=6V,四组,单向,8KV,15KV; Manufacturer Character: 中国大陆; Manufacturer: 上海雷卯电子科技有限公司（Leiditech）; Eco-Label: ROHS; Operation Temperature（℃）: -55~+125(Tj); room: SD; As-Welded: /; ERP Number: 005.0001.0017.00061; PCB Footprint: SOT363; ERP PCB Footprint: SOT363; Manufacturer Part Number: PRTR5V0U4Y; Manufacturer PartNumber: LC0504F; Temperature: -40~85℃; Part Status: 优选